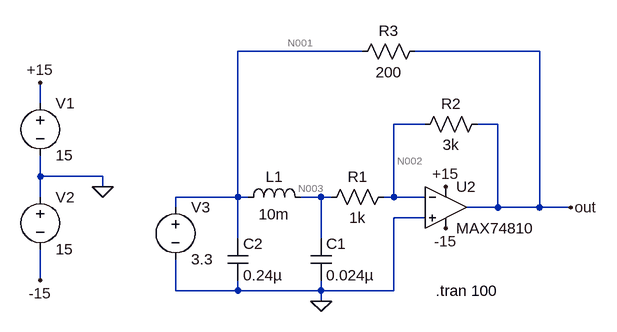
[diagram p0: schematic Draft3.asc]
Draft3.asc, the LTspice schematic file:
Version 4.1
SHEET 1 880 680
WIRE 272 -64 80 -64
WIRE 544 -64 352 -64
WIRE -224 16 -224 -16
WIRE 368 48 320 48
WIRE 480 48 448 48
WIRE -224 128 -224 96
WIRE -128 128 -224 128
WIRE -128 144 -128 128
WIRE -224 160 -224 128
WIRE 80 160 80 -64
WIRE 80 160 -16 160
WIRE 96 160 80 160
WIRE 208 160 176 160
WIRE 224 160 208 160
WIRE 320 160 320 48
WIRE 320 160 304 160
WIRE 368 160 320 160
WIRE -16 176 -16 160
WIRE 480 176 480 48
WIRE 480 176 432 176
WIRE 544 176 544 -64
WIRE 544 176 480 176
WIRE 592 176 544 176
WIRE 368 192 320 192
WIRE 80 224 80 160
WIRE 208 224 208 160
WIRE -224 288 -224 240
WIRE -16 304 -16 256
WIRE 80 304 80 288
WIRE 80 304 -16 304
WIRE 208 304 208 288
WIRE 208 304 80 304
WIRE 320 304 320 192
WIRE 320 304 208 304
WIRE 208 320 208 304
FLAG -128 144 0
FLAG -224 -16 +15
FLAG -224 288 -15
FLAG 208 320 0
FLAG 400 144 +15
FLAG 400 208 -15
FLAG 592 176 out
SYMBOL voltage -224 0 R0
WINDOW 123 0 0 Left 0
WINDOW 39 0 0 Left 0
SYMATTR InstName V1
SYMATTR Value 15
SYMBOL voltage -224 144 R0
WINDOW 123 0 0 Left 0
WINDOW 39 0 0 Left 0
SYMATTR InstName V2
SYMATTR Value 15
SYMBOL res 320 144 R90
WINDOW 0 0 56 VBottom 2
WINDOW 3 32 56 VTop 2
SYMATTR InstName R1
SYMATTR Value 1k
SYMBOL res 464 32 R90
WINDOW 0 0 56 VBottom 2
WINDOW 3 32 56 VTop 2
SYMATTR InstName R2
SYMATTR Value 3k
SYMBOL res 368 -80 R90
WINDOW 0 0 56 VBottom 2
WINDOW 3 32 56 VTop 2
SYMATTR InstName R3
SYMATTR Value 200
SYMBOL ind 80 176 R270
WINDOW 0 32 56 VTop 2
WINDOW 3 5 56 VBottom 2
SYMATTR InstName L1
SYMATTR Value 10m
SYMBOL cap 192 224 R0
SYMATTR InstName C1
SYMATTR Value 0.024µ
SYMBOL cap 64 224 R0
SYMATTR InstName C2
SYMATTR Value 0.24µ
SYMBOL OpAmps\\MAX74810 400 112 R0
SYMATTR InstName U2
SYMBOL voltage -16 160 R0
SYMATTR InstName V3
SYMATTR Value 3.3
TEXT 384 304 Left 2 !.tran 100

The netlist it stands for:
* Draft3.asc
V1 +15 0 15
V2 0 -15 15
R1 N002 N003 1k
R2 out N002 3k
R3 out N001 200
L1 N001 N003 10m
C1 N003 0 0.024µ
C2 N001 0 0.24µ
X§U2 0 N002 +15 -15 out MAX74810  ; pins In+ In- V+ V- OUT
V3 N001 0 3.3
.tran 100
.backanno
.end

* Results of the author's LTspice run, read from the files saved beside the schematic
* Operating Point, zero values left out:
*   V(-15) = -15 V
*   V(n003) = 3.3 V
*   V(out) = -2.74 V
*   V(+15) = 15 V
*   V(n002) = 1.747 V
*   V(n001) = 3.3 V
*   I(V1) = -830 µA
*   I(R3) = -30.2 mA
*   I(R1) = -1.553 mA
*   I(L1) = 1.553 mA
*   I(V3) = -31.76 mA
*   I(R2) = -1.496 mA
*   I(V2) = -32.53 mA
*   Ix(u2:1) = -57.46 µA
*   Ix(u2:2) = 57.46 µA
*   Ix(u2:3) = 830 µA
*   Ix(u2:4) = -32.53 mA
*   Ix(u2:5) = 31.7 mA